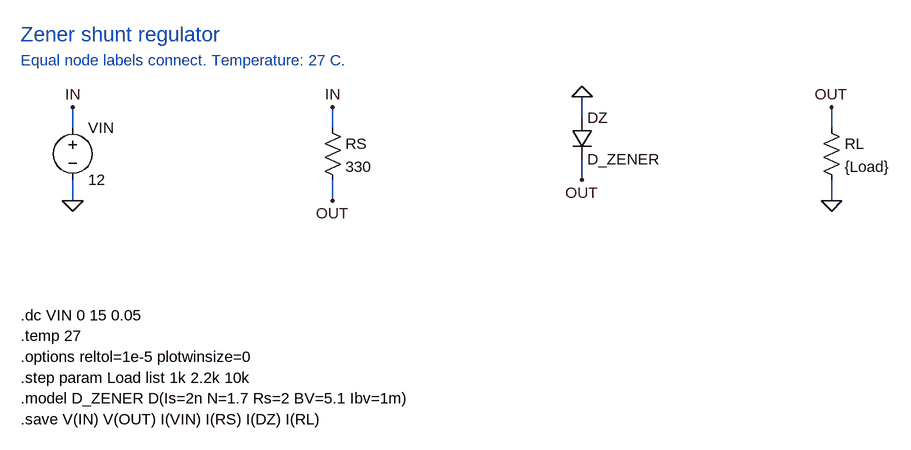
[diagram p0: schematic zener-regulator.asc]
zener-regulator.asc, the LTspice schematic file:
Version 4
SHEET 1 1740 776
WIRE 144 176 144 144
WIRE 144 256 144 288
WIRE 544 176 544 144
WIRE 544 256 544 288
WIRE 928 160 928 128
WIRE 928 224 928 256
WIRE 1312 176 1312 144
WIRE 1312 256 1312 288
FLAG 144 144 IN
FLAG 144 288 0
FLAG 544 144 IN
FLAG 544 288 OUT
FLAG 928 128 0
FLAG 928 256 OUT
FLAG 1312 144 OUT
FLAG 1312 288 0
SYMBOL voltage 144 160 R0
SYMATTR InstName VIN
SYMATTR Value 12
SYMBOL res 528 160 R0
SYMATTR InstName RS
SYMATTR Value 330
SYMBOL diode 912 160 R0
SYMATTR InstName DZ
SYMATTR Value D_ZENER
SYMBOL res 1296 160 R0
SYMATTR InstName RL
SYMATTR Value {Load}
TEXT 64 32 Left 3 ;Zener shunt regulator
TEXT 64 72 Left 2 ;Equal node labels connect. Temperature: 27 C.
TEXT 64 464 Left 2 !.dc VIN 0 15 0.05
TEXT 64 496 Left 2 !.temp 27
TEXT 64 528 Left 2 !.options reltol=1e-5 plotwinsize=0
TEXT 64 560 Left 2 !.step param Load list 1k 2.2k 10k
TEXT 64 592 Left 2 !.model D_ZENER D(Is=2n N=1.7 Rs=2 BV=5.1 Ibv=1m)
TEXT 64 624 Left 2 !.save V(IN) V(OUT) I(VIN) I(RS) I(DZ) I(RL)

The netlist it stands for:
* zener-regulator.asc
VIN IN 0 12
RS IN OUT 330
DZ 0 OUT D_ZENER
RL OUT 0 {Load}
.model D D
.lib standard.dio
* Zener shunt regulator
* Equal node labels connect. Temperature: 27 C.
.dc VIN 0 15 0.05
.temp 27
.options reltol=1e-5 plotwinsize=0
.step param Load list 1k 2.2k 10k
.model D_ZENER D(Is=2n N=1.7 Rs=2 BV=5.1 Ibv=1m)
.save V(IN) V(OUT) I(VIN) I(RS) I(DZ) I(RL)
.backanno
.end